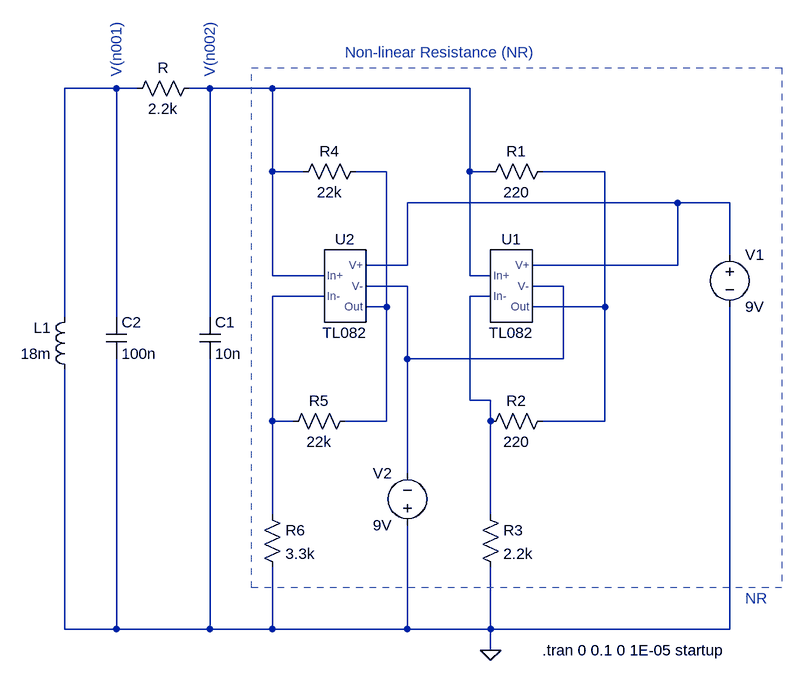
[diagram p0: schematic chua_TL082.asc]
chua_TL082.asc, the LTspice schematic file:
Version 4
SHEET 1 900 760
WIRE -128 -144 -208 -144
WIRE -96 -144 -128 -144
WIRE 16 -144 -16 -144
WIRE 112 -144 16 -144
WIRE 416 -144 112 -144
WIRE 112 -16 112 -144
WIRE 160 -16 112 -16
WIRE 288 -16 240 -16
WIRE 416 -16 416 -144
WIRE 448 -16 416 -16
WIRE 624 -16 528 -16
WIRE 736 32 320 32
WIRE 816 32 736 32
WIRE 816 112 816 32
WIRE 320 128 320 32
WIRE 320 128 256 128
WIRE 736 128 736 32
WIRE 736 128 512 128
WIRE 112 144 112 -16
WIRE 192 144 112 144
WIRE 416 144 416 -16
WIRE 448 144 416 144
WIRE 320 160 256 160
WIRE 560 160 512 160
WIRE 192 176 112 176
WIRE 448 176 416 176
WIRE 288 192 288 -16
WIRE 288 192 256 192
WIRE 624 192 624 -16
WIRE 624 192 512 192
WIRE -208 208 -208 -144
WIRE -128 208 -128 -144
WIRE 16 208 16 -144
WIRE 320 272 320 160
WIRE 560 272 560 160
WIRE 560 272 320 272
WIRE 416 336 416 176
WIRE 448 336 416 336
WIRE 112 368 112 176
WIRE 144 368 112 368
WIRE 288 368 288 192
WIRE 288 368 224 368
WIRE 448 368 448 336
WIRE 624 368 624 192
WIRE 624 368 528 368
WIRE 320 448 320 272
WIRE 112 512 112 368
WIRE 448 512 448 368
WIRE -208 688 -208 288
WIRE -128 688 -128 272
WIRE -128 688 -208 688
WIRE 16 688 16 272
WIRE 16 688 -128 688
WIRE 112 688 112 592
WIRE 112 688 16 688
WIRE 320 688 320 528
WIRE 320 688 112 688
WIRE 448 688 448 592
WIRE 448 688 320 688
WIRE 816 688 816 192
WIRE 816 688 448 688
WIRE 448 720 448 688
FLAG 448 720 0
SYMBOL TL082 480 160 R0
SYMATTR InstName U1
SYMBOL TL082 224 160 R0
SYMATTR InstName U2
SYMBOL res 544 -32 R90
WINDOW 0 0 56 VBottom 2
WINDOW 3 32 56 VTop 2
SYMATTR InstName R1
SYMATTR Value 220
SYMATTR SpiceLine tol=5
SYMBOL res 544 352 R90
WINDOW 0 0 56 VBottom 2
WINDOW 3 32 56 VTop 2
SYMATTR InstName R2
SYMATTR Value 220
SYMATTR SpiceLine tol=5
SYMBOL res 432 496 R0
SYMATTR InstName R3
SYMATTR Value 2.2k
SYMATTR SpiceLine tol=5
SYMBOL voltage 320 544 R180
WINDOW 0 24 96 Left 2
WINDOW 3 24 16 Left 2
WINDOW 123 0 0 Left 0
WINDOW 39 0 0 Left 0
SYMATTR InstName V2
SYMATTR Value 9V
SYMBOL voltage 816 96 R0
WINDOW 123 0 0 Left 0
WINDOW 39 0 0 Left 0
SYMATTR InstName V1
SYMATTR Value 9V
SYMBOL res 256 -32 R90
WINDOW 0 0 56 VBottom 2
WINDOW 3 32 56 VTop 2
SYMATTR InstName R4
SYMATTR Value 22k
SYMATTR SpiceLine tol=5
SYMBOL res 240 352 R90
WINDOW 0 0 56 VBottom 2
WINDOW 3 32 56 VTop 2
SYMATTR InstName R5
SYMATTR Value 22k
SYMATTR SpiceLine tol=2
SYMBOL res 96 496 R0
SYMATTR InstName R6
SYMATTR Value 3.3k
SYMATTR SpiceLine tol=5
SYMBOL res 0 -160 R90
WINDOW 0 0 56 VBottom 2
WINDOW 3 32 56 VTop 2
SYMATTR InstName R
SYMATTR Value 2.2k
SYMBOL cap 0 208 R0
SYMATTR InstName C1
SYMATTR Value 10n
SYMBOL ind -192 304 R180
WINDOW 0 36 80 Left 2
WINDOW 3 36 40 Left 2
SYMATTR InstName L1
SYMATTR Value 18m
SYMBOL cap -144 208 R0
SYMATTR InstName C2
SYMATTR Value 100n
TEXT 840 640 Left 2 ;NR
TEXT 16 -248 VRight 2 ;V(n002)
TEXT -128 -248 VRight 2 ;V(n001)
TEXT 224 -200 Left 2 ;Non-linear Resistance (NR)
TEXT 528 720 Left 2 !.tran 0 0.1 0 1E-05 startup
RECTANGLE Normal 896 624 80 -176 2

The netlist it stands for:
* chua_TL082.asc
XU1 N002 N008 N005 N006 N004 TL082  ; pins In+ In- V+ V- Out
XU2 N002 N007 N005 N006 N003 TL082  ; pins In+ In- V+ V- Out
R1 N004 N002 220 tol=5
R2 N004 N008 220 tol=5
R3 N008 0 2.2k tol=5
V2 0 N006 9V
V1 N005 0 9V
R4 N003 N002 22k tol=5
R5 N003 N007 22k tol=2
R6 N007 0 3.3k tol=5
R N002 N001 2.2k
C1 N002 0 10n
L1 0 N001 18m
C2 N001 0 100n
* NR
* V(n002)
* V(n001)
* Non-linear Resistance (NR)
.tran 0 0.1 0 1E-05 startup
.lib TL082.sub
.backanno
.end